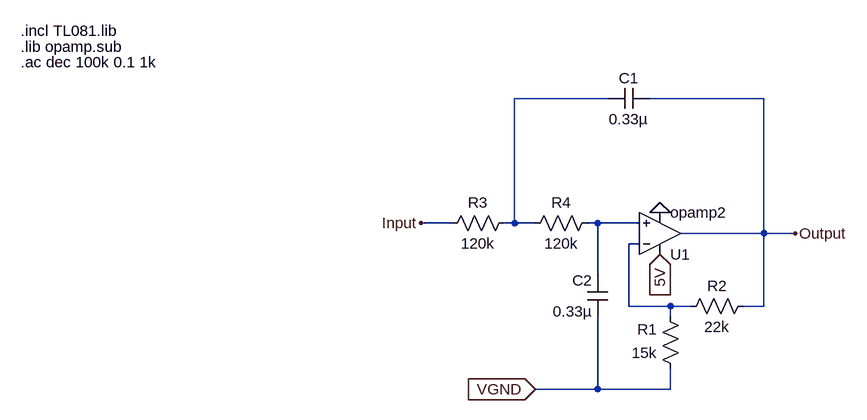
[diagram p0: schematic LPF.asc]
LPF.asc, the LTspice schematic file:
Version 4
SHEET 1 880 680
WIRE 416 -112 272 -112
WIRE 656 -112 480 -112
WIRE 176 80 128 80
WIRE 272 80 272 -112
WIRE 272 80 256 80
WIRE 304 80 272 80
WIRE 400 80 384 80
WIRE 464 80 400 80
WIRE 656 96 656 -112
WIRE 656 96 528 96
WIRE 704 96 656 96
WIRE 464 112 448 112
WIRE 400 160 400 80
WIRE 448 208 448 112
WIRE 512 208 448 208
WIRE 544 208 512 208
WIRE 656 208 656 96
WIRE 656 208 624 208
WIRE 512 224 512 208
WIRE 400 336 400 224
WIRE 400 336 304 336
WIRE 512 336 512 304
WIRE 512 336 400 336
FLAG 496 128 5V
IOPIN 496 128 In
FLAG 304 336 VGND
IOPIN 304 336 In
FLAG 128 80 Input
FLAG 704 96 Output
FLAG 496 64 0
SYMBOL res 528 320 R180
WINDOW 0 36 76 Left 2
WINDOW 3 36 40 Left 2
SYMATTR InstName R1
SYMATTR Value 15k
SYMBOL res 640 192 R90
WINDOW 0 0 56 VBottom 2
WINDOW 3 32 56 VTop 2
SYMATTR InstName R2
SYMATTR Value 22k
SYMBOL res 272 64 R90
WINDOW 0 0 56 VBottom 2
WINDOW 3 32 56 VTop 2
SYMATTR InstName R3
SYMATTR Value 120k
SYMBOL res 400 64 R90
WINDOW 0 0 56 VBottom 2
WINDOW 3 32 56 VTop 2
SYMATTR InstName R4
SYMATTR Value 120k
SYMBOL cap 480 -128 R90
WINDOW 0 0 32 VBottom 2
WINDOW 3 32 32 VTop 2
SYMATTR InstName C1
SYMATTR Value 0.33µ
SYMBOL cap 416 224 R180
WINDOW 0 24 56 Left 2
WINDOW 3 24 8 Left 2
SYMATTR InstName C2
SYMATTR Value 0.33µ
SYMBOL Opamps\\opamp2 496 160 M180
SYMATTR InstName U1
TEXT -488 -216 Left 2 !.incl TL081.lib
TEXT -488 -168 Left 2 !.ac dec 100k 0.1 1k
TEXT -488 -192 Left 2 !.lib opamp.sub

The netlist it stands for:
* LPF.asc
R1 VGND N003 15k
R2 Output N003 22k
R3 N001 Input 120k
R4 N002 N001 120k
C1 Output N001 0.33µ
C2 VGND N002 0.33µ
XU1 N002 N003 5V 0 Output opamp2  ; pins In+ In- V+ V- OUT
.incl TL081.lib
.ac dec 100k 0.1 1k
.lib opamp.sub
.backanno
.end